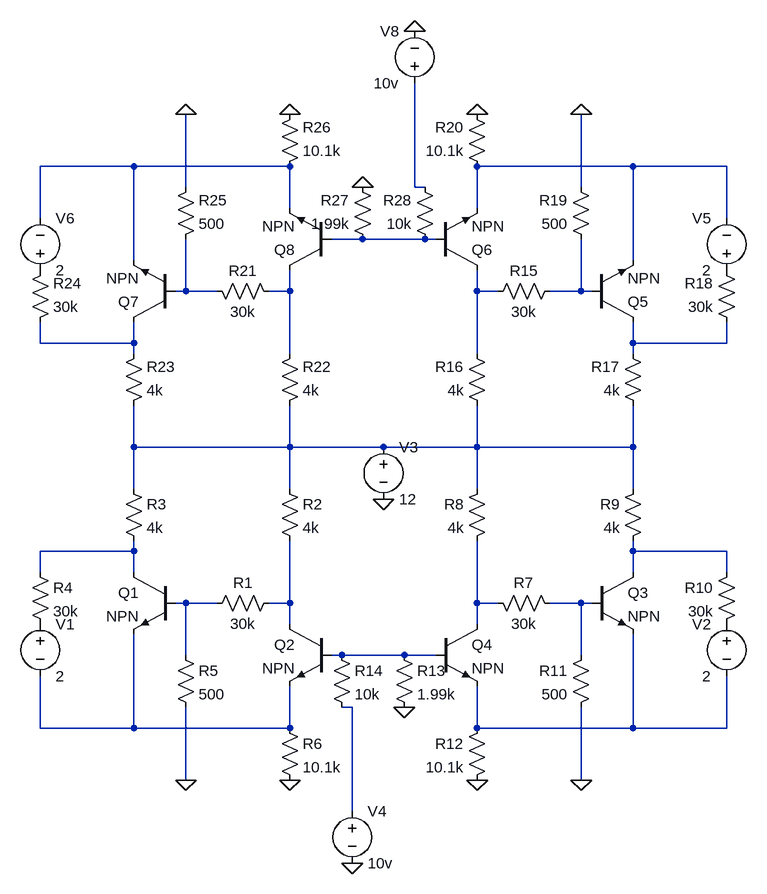
[diagram p0: schematic inverted amplifier.asc]
inverted amplifier.asc, the LTspice schematic file:
Version 4.1
SHEET 1 1028 680
WIRE 80 -544 -64 -544
WIRE 320 -544 80 -544
WIRE 848 -544 608 -544
WIRE 992 -544 848 -544
WIRE 160 -512 160 -624
WIRE 512 -512 512 -672
WIRE 528 -512 512 -512
WIRE 768 -512 768 -624
WIRE 320 -480 320 -544
WIRE 608 -480 608 -544
WIRE -64 -464 -64 -544
WIRE 992 -464 992 -544
WIRE 432 -432 384 -432
WIRE 528 -432 432 -432
WIRE 544 -432 528 -432
WIRE 80 -400 80 -544
WIRE 848 -400 848 -544
WIRE 160 -352 160 -432
WIRE 160 -352 144 -352
WIRE 208 -352 160 -352
WIRE 320 -352 320 -384
WIRE 320 -352 288 -352
WIRE 608 -352 608 -384
WIRE 640 -352 608 -352
WIRE 768 -352 768 -432
WIRE 768 -352 720 -352
WIRE 784 -352 768 -352
WIRE -64 -272 -64 -304
WIRE 80 -272 80 -304
WIRE 80 -272 -64 -272
WIRE 848 -272 848 -304
WIRE 992 -272 992 -304
WIRE 992 -272 848 -272
WIRE 80 -256 80 -272
WIRE 320 -256 320 -352
WIRE 608 -256 608 -352
WIRE 848 -256 848 -272
WIRE 80 -112 80 -176
WIRE 320 -112 320 -176
WIRE 320 -112 80 -112
WIRE 464 -112 320 -112
WIRE 608 -112 608 -176
WIRE 608 -112 464 -112
WIRE 848 -112 848 -176
WIRE 848 -112 608 -112
WIRE 80 -48 80 -112
WIRE 320 -48 320 -112
WIRE 608 -48 608 -112
WIRE 848 -48 848 -112
WIRE 80 48 80 32
WIRE 80 48 -64 48
WIRE 848 48 848 32
WIRE 992 48 848 48
WIRE -64 80 -64 48
WIRE 80 80 80 48
WIRE 848 80 848 48
WIRE 992 80 992 48
WIRE 160 128 144 128
WIRE 208 128 160 128
WIRE 320 128 320 32
WIRE 320 128 288 128
WIRE 608 128 608 32
WIRE 640 128 608 128
WIRE 768 128 720 128
WIRE 784 128 768 128
WIRE 320 160 320 128
WIRE 608 160 608 128
WIRE 160 208 160 128
WIRE 400 208 384 208
WIRE 496 208 400 208
WIRE 544 208 496 208
WIRE 768 208 768 128
WIRE 416 288 400 288
WIRE -64 320 -64 240
WIRE 80 320 80 176
WIRE 80 320 -64 320
WIRE 320 320 320 256
WIRE 320 320 80 320
WIRE 608 320 608 256
WIRE 848 320 848 176
WIRE 848 320 608 320
WIRE 992 320 992 240
WIRE 992 320 848 320
WIRE 160 400 160 288
WIRE 768 400 768 288
WIRE 416 448 416 288
FLAG 160 400 0
FLAG 768 400 0
FLAG 320 400 0
FLAG 608 400 0
FLAG 464 -32 0
FLAG 496 288 0
FLAG 416 528 0
FLAG 768 -624 0
FLAG 160 -624 0
FLAG 608 -624 0
FLAG 320 -624 0
FLAG 432 -512 0
FLAG 512 -752 0
SYMBOL npn 144 80 M0
SYMATTR InstName Q1
SYMBOL npn 384 160 M0
SYMATTR InstName Q2
SYMBOL res 304 112 R90
WINDOW 0 0 56 VBottom 2
WINDOW 3 32 56 VTop 2
SYMATTR InstName R1
SYMATTR Value 30k
SYMBOL res 304 -64 R0
SYMATTR InstName R2
SYMATTR Value 4k
SYMBOL res 64 -64 R0
SYMATTR InstName R3
SYMATTR Value 4k
SYMBOL res -80 64 R0
SYMATTR InstName R4
SYMATTR Value 30k
SYMBOL voltage -64 144 R0
SYMATTR InstName V1
SYMATTR Value 2
SYMBOL res 144 192 R0
SYMATTR InstName R5
SYMATTR Value 500
SYMBOL res 304 304 R0
SYMATTR InstName R6
SYMATTR Value 10.1k
SYMBOL npn 784 80 R0
SYMATTR InstName Q3
SYMBOL npn 544 160 R0
SYMATTR InstName Q4
SYMBOL res 624 112 M90
WINDOW 0 0 56 VBottom 2
WINDOW 3 32 56 VTop 2
SYMATTR InstName R7
SYMATTR Value 30k
SYMBOL res 624 -64 M0
SYMATTR InstName R8
SYMATTR Value 4k
SYMBOL res 864 -64 M0
SYMATTR InstName R9
SYMATTR Value 4k
SYMBOL res 1008 64 M0
SYMATTR InstName R10
SYMATTR Value 30k
SYMBOL voltage 992 144 M0
SYMATTR InstName V2
SYMATTR Value 2
SYMBOL res 784 192 M0
SYMATTR InstName R11
SYMATTR Value 500
SYMBOL res 624 304 M0
SYMATTR InstName R12
SYMATTR Value 10.1k
SYMBOL voltage 464 -128 R0
SYMATTR InstName V3
SYMATTR Value 12
SYMBOL res 480 192 R0
SYMATTR InstName R13
SYMATTR Value 1.99k
SYMBOL res 384 192 R0
SYMATTR InstName R14
SYMATTR Value 10k
SYMBOL voltage 416 432 R0
SYMATTR InstName V4
SYMATTR Value 10v
SYMBOL npn 784 -304 M180
SYMATTR InstName Q5
SYMBOL npn 544 -384 M180
SYMATTR InstName Q6
SYMBOL res 624 -336 R270
WINDOW 0 32 56 VTop 2
WINDOW 3 0 56 VBottom 2
SYMATTR InstName R15
SYMATTR Value 30k
SYMBOL res 624 -160 R180
WINDOW 0 36 76 Left 2
WINDOW 3 36 40 Left 2
SYMATTR InstName R16
SYMATTR Value 4k
SYMBOL res 864 -160 R180
WINDOW 0 36 76 Left 2
WINDOW 3 36 40 Left 2
SYMATTR InstName R17
SYMATTR Value 4k
SYMBOL res 1008 -288 R180
WINDOW 0 36 76 Left 2
WINDOW 3 36 40 Left 2
SYMATTR InstName R18
SYMATTR Value 30k
SYMBOL voltage 992 -368 R180
WINDOW 0 24 96 Left 2
WINDOW 3 24 16 Left 2
SYMATTR InstName V5
SYMATTR Value 2
SYMBOL res 784 -416 R180
WINDOW 0 36 76 Left 2
WINDOW 3 36 40 Left 2
SYMATTR InstName R19
SYMATTR Value 500
SYMBOL res 624 -528 R180
WINDOW 0 36 76 Left 2
WINDOW 3 36 40 Left 2
SYMATTR InstName R20
SYMATTR Value 10.1k
SYMBOL npn 144 -304 R180
SYMATTR InstName Q7
SYMBOL npn 384 -384 R180
SYMATTR InstName Q8
SYMBOL res 304 -336 M270
WINDOW 0 32 56 VTop 2
WINDOW 3 0 56 VBottom 2
SYMATTR InstName R21
SYMATTR Value 30k
SYMBOL res 304 -160 M180
WINDOW 0 36 76 Left 2
WINDOW 3 36 40 Left 2
SYMATTR InstName R22
SYMATTR Value 4k
SYMBOL res 64 -160 M180
WINDOW 0 36 76 Left 2
WINDOW 3 36 40 Left 2
SYMATTR InstName R23
SYMATTR Value 4k
SYMBOL res -80 -288 M180
WINDOW 0 36 76 Left 2
WINDOW 3 36 40 Left 2
SYMATTR InstName R24
SYMATTR Value 30k
SYMBOL voltage -64 -368 M180
WINDOW 0 24 96 Left 2
WINDOW 3 24 16 Left 2
SYMATTR InstName V6
SYMATTR Value 2
SYMBOL res 144 -416 M180
WINDOW 0 36 76 Left 2
WINDOW 3 36 40 Left 2
SYMATTR InstName R25
SYMATTR Value 500
SYMBOL res 304 -528 M180
WINDOW 0 36 76 Left 2
WINDOW 3 36 40 Left 2
SYMATTR InstName R26
SYMATTR Value 10.1k
SYMBOL res 448 -416 R180
WINDOW 0 36 76 Left 2
WINDOW 3 36 40 Left 2
SYMATTR InstName R27
SYMATTR Value 1.99k
SYMBOL res 544 -416 R180
WINDOW 0 36 76 Left 2
WINDOW 3 36 40 Left 2
SYMATTR InstName R28
SYMATTR Value 10k
SYMBOL voltage 512 -656 R180
WINDOW 0 24 96 Left 2
WINDOW 3 24 16 Left 2
SYMATTR InstName V8
SYMATTR Value 10v

The netlist it stands for:
* inverted amplifier.asc
Q1 N012 N014 N020 0 NPN
Q2 N015 N018 N020 0 NPN
R1 N015 N014 30k
R2 N011 N015 4k
R3 N011 N012 4k
R4 N012 P001 30k
V1 P001 N020 2
R5 N014 0 500
R6 N020 0 10.1k
Q3 N013 N017 N021 0 NPN
Q4 N016 N018 N021 0 NPN
R7 N016 N017 30k
R8 N011 N016 4k
R9 N011 N013 4k
R10 N013 P002 30k
V2 P002 N021 2
R11 N017 0 500
R12 N021 0 10.1k
V3 N011 0 12
R13 N018 0 1.99k
R14 N018 N019 10k
V4 N019 0 10v
Q5 N010 N008 N002 0 NPN
Q6 N007 N004 N002 0 NPN
R15 N007 N008 30k
R16 N011 N007 4k
R17 N011 N010 4k
R18 N010 P003 30k
V5 P003 N002 2
R19 N008 0 500
R20 N002 0 10.1k
Q7 N009 N005 N001 0 NPN
Q8 N006 N004 N001 0 NPN
R21 N006 N005 30k
R22 N011 N006 4k
R23 N011 N009 4k
R24 N009 P004 30k
V6 P004 N001 2
R25 N005 0 500
R26 N001 0 10.1k
R27 N004 0 1.99k
R28 N004 N003 10k
V8 N003 0 10v
.model NPN NPN
.model PNP PNP
.lib standard.bjt
.backanno
.end